# EAGLE schematic board SCH (EAGLE 7.6.0)
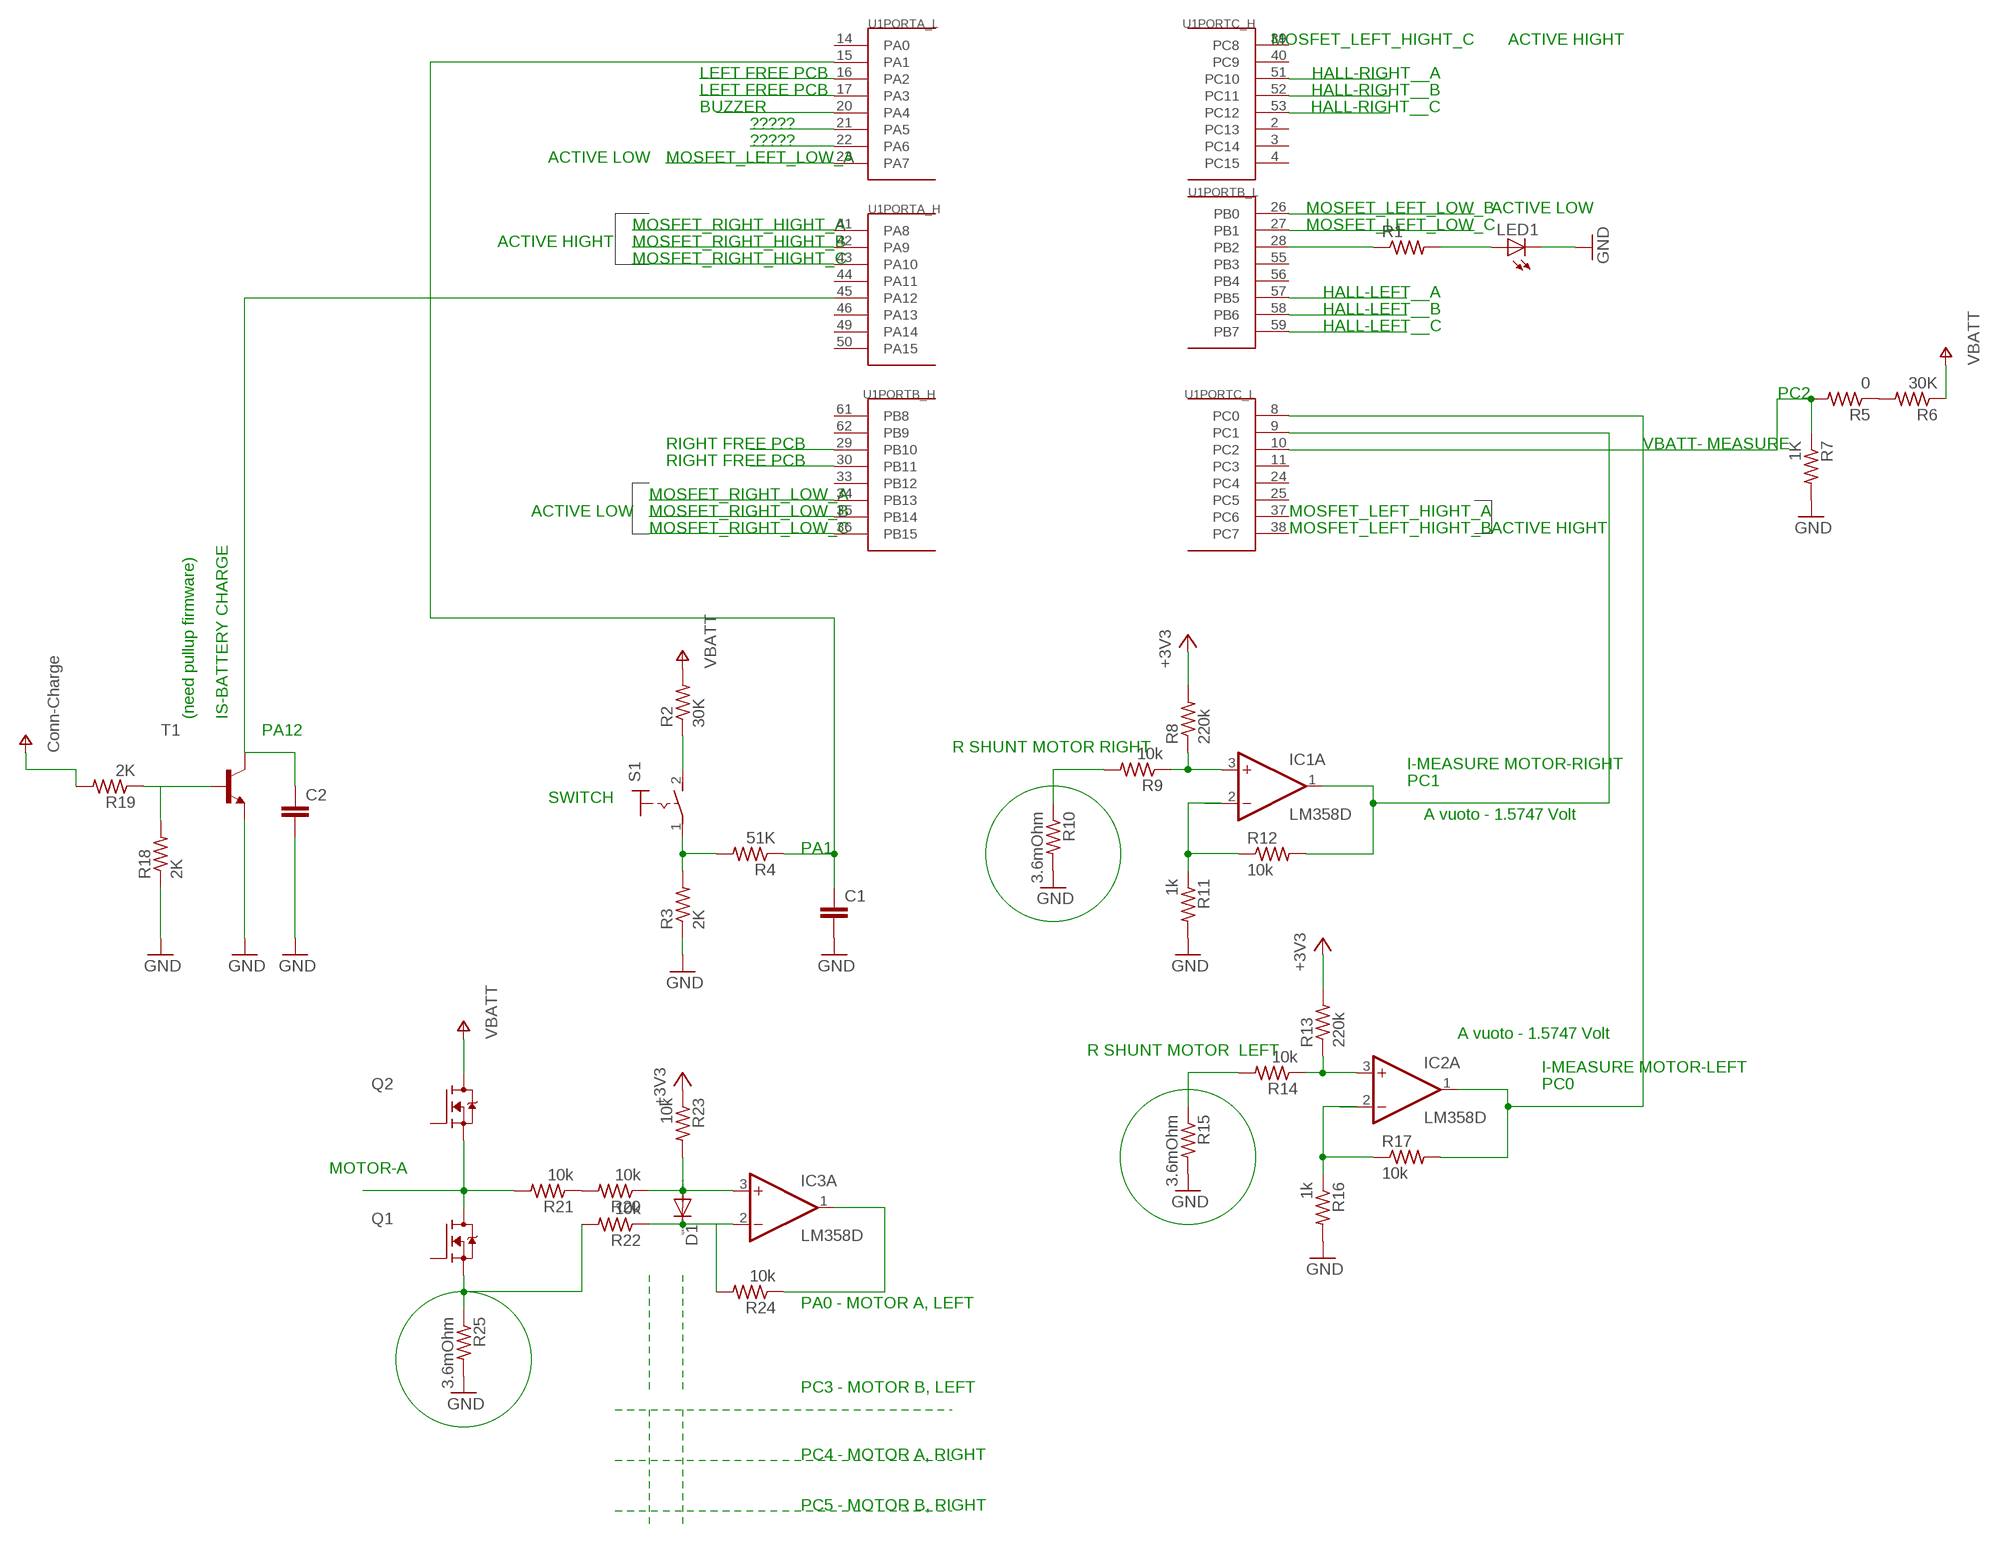
[diagram p0: schematic, sheet 1]

## Parts
C1  C-EUC4532  [C4532]
C2  C-EUC4532  [C4532]
D1  1N4148DO35-7  [DO35-7]
IC1  LM358D  [SO08]
IC2  LM358D  [SO08]
IC3  LM358D  [SO08]
LED1  LED  [SMARTLED-TTW]
Q1  SPW47N60S5  [P-TO247]
Q2  SPW47N60S5  [P-TO247]
R1  R-US_M0805  [M0805]
R2  30K  R-US_M0805  [M0805]
R3  2K  R-US_M0805  [M0805]
R4  51K  R-US_M0805  [M0805]
R5  0  R-US_M0805  [M0805]
R6  30K  R-US_M0805  [M0805]
R7  1K  R-US_M0805  [M0805]
R8  220k  R-US_M0805  [M0805]
R9  10k  R-US_M0805  [M0805]
R10  3.6mOhm  R-US_M0805  [M0805]
R11  1k  R-US_M0805  [M0805]
R12  10k  R-US_M0805  [M0805]
R13  220k  R-US_M0805  [M0805]
R14  10k  R-US_M0805  [M0805]
R15  3.6mOhm  R-US_M0805  [M0805]
R16  1k  R-US_M0805  [M0805]
R17  10k  R-US_M0805  [M0805]
R18  2K  R-US_M0805  [M0805]
R19  2K  R-US_M0805  [M0805]
R20  10k  R-US_M0805  [M0805]
R21  10k  R-US_M0805  [M0805]
R22  10k  R-US_M0805  [M0805]
R23  10k  R-US_M0805  [M0805]
R24  10k  R-US_M0805  [M0805]
R25  3.6mOhm  R-US_M0805  [M0805]
S1  MS243  [MS243]
T1  -NPN-SOT23-EBC  [SOT23-EBC]
U1  STM32F10XRXT6  [TQFP64]

## Nets
+3V3: R8.2 R13.2 R23.1
GND: C1.2 C2.2 LED1.C@1(C) R3.1 R7.2 R10.2 R11.2 R15.2 R16.2 R18.1 R25.2 T1.E
N$1: U1.51(PORTC_H:PC10)
N$2: U1.52(PORTC_H:PC11)
N$3: U1.53(PORTC_H:PC12)
N$4: U1.57(PORTB_L:PB5)
N$5: U1.58(PORTB_L:PB6)
N$6: U1.59(PORTB_L:PB7)
N$7: R1.1 U1.28(PORTB_L:PB2)
N$8: LED1.A@1(A) R1.2
N$9: U1.20(PORTA_L:PA4)
N$10: U1.29(PORTB_H:PB10)
N$11: U1.30(PORTB_H:PB11)
N$12: U1.17(PORTA_L:PA3)
N$13: U1.16(PORTA_L:PA2)
N$14: U1.36(PORTB_H:PB15)
N$15: U1.35(PORTB_H:PB14)
N$16: U1.34(PORTB_H:PB13)
N$17: U1.43(PORTA_H:PA10)
N$18: U1.42(PORTA_H:PA9)
N$19: U1.41(PORTA_H:PA8)
N$20: U1.26(PORTB_L:PB0)
N$21: U1.27(PORTB_L:PB1)
N$22: U1.23(PORTA_L:PA7)
N$23: R2.1 S1.2(S)
N$24: R3.2 R4.2 S1.1(P)
N$25: R5.1 R6.2
N$26: C1.1 R4.1 U1.15(PORTA_L:PA1)
N$27: R5.2 R7.1 U1.10(PORTC_L:PC2)
N$28: R9.2 R10.1
N$29: IC1.3(A:+IN) R8.1 R9.1
N$30: IC1.2(A:-IN) R11.1 R12.1
N$31: IC1.1(A:OUT) R12.2 U1.9(PORTC_L:PC1)
N$32: IC2.3(A:+IN) R13.1 R14.1
N$33: R14.2 R15.1
N$34: IC2.2(A:-IN) R16.1 R17.1
N$35: IC2.1(A:OUT) R17.2 U1.8(PORTC_L:PC0)
N$36: R18.2 R19.1 T1.B
N$37: C2.1 T1.C U1.45(PORTA_H:PA12)
N$39: U1.21(PORTA_L:PA5)
N$40: U1.22(PORTA_L:PA6)
N$41: D1.A IC3.3(A:+IN) R20.1 R23.2
N$42: R20.2 R21.1
N$43: D1.C IC3.2(A:-IN) R22.1 R24.2
N$44: IC3.1(A:OUT) R24.1
N$45: Q1.3(S) R22.2 R25.1
N$46: Q1.2(D) Q2.3(S) R21.2
V-: Q2.2(D) R6.1 R19.2 ; supply symbol labelled VBATT, Conn-Charge
VBATT: R2.2
Unconnected: IC1.5(B:+IN) IC1.6(B:-IN) IC1.7(B:OUT) IC2.5(B:+IN) IC2.6(B:-IN) IC2.7(B:OUT) IC3.5(B:+IN) IC3.6(B:-IN) IC3.7(B:OUT) Q1.1(G) Q2.1(G) U1.2(PORTC_H:PC13) U1.3(PORTC_H:PC14) U1.4(PORTC_H:PC15) U1.5(PORTD/OSC:PD0/OSC<=) U1.6(PORTD/OSC:PD1/OSC=>) U1.7(RESET:NRST) U1.11(PORTC_L:PC3) U1.14(PORTA_L:PA0) U1.24(PORTC_L:PC4) U1.25(PORTC_L:PC5) U1.33(PORTB_H:PB12) U1.37(PORTC_L:PC6) U1.38(PORTC_L:PC7) U1.39(PORTC_H:PC8) U1.40(PORTC_H:PC9) U1.44(PORTA_H:PA11) U1.46(PORTA_H:PA13) U1.49(PORTA_H:PA14) U1.50(PORTA_H:PA15) U1.54(PORTD/OSC:PD2) U1.55(PORTB_L:PB3) U1.56(PORTB_L:PB4) U1.60(RESET:BOOT0) U1.61(PORTB_H:PB8) U1.62(PORTB_H:PB9)

## Notes on the sheet
- MOSFET_LEFT_HIGHT_C | ACTIVE HIGHT
- LEFT FREE PCB | HALL-RIGHT__A
- LEFT FREE PCB | HALL-RIGHT__B
- BUZZER | HALL-RIGHT__C
- ?????
- ?????
- ACTIVE LOW | MOSFET_LEFT_LOW_A
- MOSFET_LEFT_LOW_B | ACTIVE LOW
- MOSFET_RIGHT_HIGHT_A | MOSFET_LEFT_LOW_C
- ACTIVE HIGHT | MOSFET_RIGHT_HIGHT_B
- MOSFET_RIGHT_HIGHT_C
- HALL-LEFT__A
- HALL-LEFT__B
- HALL-LEFT__C
- PC2
- RIGHT FREE PCB | VBATT- MEASURE
- RIGHT FREE PCB
- MOSFET_RIGHT_LOW_A
- ACTIVE LOW | MOSFET_RIGHT_LOW_B | MOSFET_LEFT_HIGHT_A
- MOSFET_RIGHT_LOW_C | MOSFET_LEFT_HIGHT_B | ACTIVE HIGHT
- (need pullup firmware) | IS-BATTERY CHARGE
- PA12
- R SHUNT MOTOR RIGHT
- I-MEASURE MOTOR-RIGHT
- PC1
- SWITCH
- A vuoto - 1.5747 Volt
- PA1
- A vuoto - 1.5747 Volt
- R SHUNT MOTOR  LEFT
- I-MEASURE MOTOR-LEFT
- PC0
- MOTOR-A
- PA0 - MOTOR A, LEFT
- PC3 - MOTOR B, LEFT
- PC4 - MOTOR A, RIGHT
- PC5 - MOTOR B, RIGHT

## Power pins joined to a net without a drawn wire
V+: IC1.8(P:V+) IC2.8(P:V+) IC3.8(P:V+)
V-: IC1.4(P:V-) IC2.4(P:V-) IC3.4(P:V-)
VBAT: U1.1(AN_POWER:VBAT)
VDD_1: U1.32(POWER:VDD_1)
VDD_2: U1.48(POWER:VDD_2)
VDD_3: U1.64(POWER:VDD_3)
VDD_4: U1.19(POWER:VDD_4)
VDDA: U1.13(AN_POWER:VDDA)
VSS_1: U1.31(POWER:VSS_1)
VSS_2: U1.47(POWER:VSS_2)
VSS_3: U1.63(POWER:VSS_3)
VSS_4: U1.18(POWER:VSS_4)
VSSA: U1.12(AN_POWER:VSSA)

## Library data of the parts
C1 C2 = rcl:C-EU: CAPACITOR, European symbol
D1 = diode:1N4148: DIODE high speed (Philips)
IC1-IC3 = linear:LM358: OP AMP also LM158; LM258; LM2904 Source: http://cache.national.com/ds/LM/LM158.pdf
LED1 = led:LED: LED OSRAM: - CHIPLED LG R971, LG N971, LY N971, LG Q971, LY Q971, LO R971, LY R971 LH N974, LH R974 LS Q976, LO Q976, LY Q976 LO Q996 - Hyper CHIPLED LW Q18S LB Q993, LB Q99A, LB R99A - SideLED LS A670, LO A670, LY A670, LG A670, LP A670 LB A673, LV A673, LT A673, LW A673 LH A674 LY A675 LS A676, LA A676, LO A676, LY A676, LW A676 LS A679, LY A679, LG A679 - Hyper Micro SIDELED® LS Y876, LA Y876, LO Y876, LY Y876 LT Y87S - SmartLED LW L88C, LW L88S LB L89C, LB L89S, LG L890 LS L89K, LO L89K, LY L89K LS L896, LA L896, LO L896, LY L896 - TOPLED LS T670, LO T670, LY T670, LG T670, LP T670 LSG T670, LSP T670, LSY T670, LOP T670, LYG T670 LG T671, LOG T671, LSG T671 LB T673, LV T673, LT T673, LW T673 LH T674 LS T676, LA T676, LO T676, LY T676, LB T676, LH T676, LSB T676, LW T676 LB T67C, LV T67C, LT T67C, LS T67K, LO T67K, LY T67K, LW E67C LS E67B, LA E67B, LO E67B, LY E67B, LB E67C, LV E67C, LT E67C LW T67C LS T679, LY T679, LG T679 LS T770, LO T770, LY T770, LG T770, LP T770 LB T773, LV T773, LT T773, LW T773 LH T774 LS E675, LA E675, LY E675, LS T675 LS T776, LA T776, LO T776, LY T776, LB T776 LHGB T686 LT T68C, LB T68C - Hyper Mini TOPLED® LB M676 - Mini TOPLED Santana® LG M470 LS M47K, LO M47K, LY M47K Source: http://www.osram.convergy.de LUXEON: - LUMILED® LXK2-PW12-R00, LXK2-PW12-S00, LXK2-PW14-U00, LXK2-PW14-V00 LXK2-PM12-R00, LXK2-PM12-S00, LXK2-PM14-U00 LXK2-PE12-Q00, LXK2-PE12-R00, LXK2-PE12-S00, LXK2-PE14-T00, LXK2-PE14-U00 LXK2-PB12-K00, LXK2-PB12-L00, LXK2-PB12-M00, LXK2-PB14-N00, LXK2-PB14-P00, LXK2-PB14-Q00 LXK2-PR12-L00, LXK2-PR12-M00, LXK2-PR14-Q00, LXK2-PR14-R00 LXK2-PD12-Q00, LXK2-PD12-R00, LXK2-PD12-S00 LXK2-PH12-R00, LXK2-PH12-S00 LXK2-PL12-P00, LXK2-PL12-Q00, LXK2-PL12-R00 Source: www.luxeon.com KINGBRIGHT: KA-3528ASYC Source: www.kingbright.com
Q1 Q2 = transistor-fet:SPW47N60S5: Cool MOS Power Transistor
R1-R25 = rcl:R-US_: RESISTOR, American symbol
S1 = switch:MS243: TOGGLE SWITCH
T1 = transistor:*-NPN-: NPN Transistror BF959 corrected 2008.03.06
U1 = stm32:STM32F10XRXT6: STM32F101/103 64pin LQFP